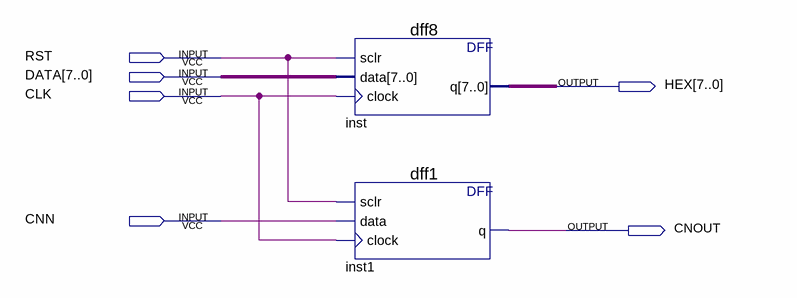
[diagram p0: schematic sheet]
// Quartus schematic DR.bdf as structural Verilog: 2 symbols, 6 pins
module DR (
  input  RST,
  input  [7:0] DATA,
  input  CLK,
  input  CNN,
  output [7:0] HEX,
  output CNOUT
);

  dff8 inst (.sclr(RST), .data(DATA), .clock(CLK), .q(HEX));
  dff1 inst1 (.sclr(RST), .data(CNN), .clock(CLK), .q(CNOUT));
endmodule
